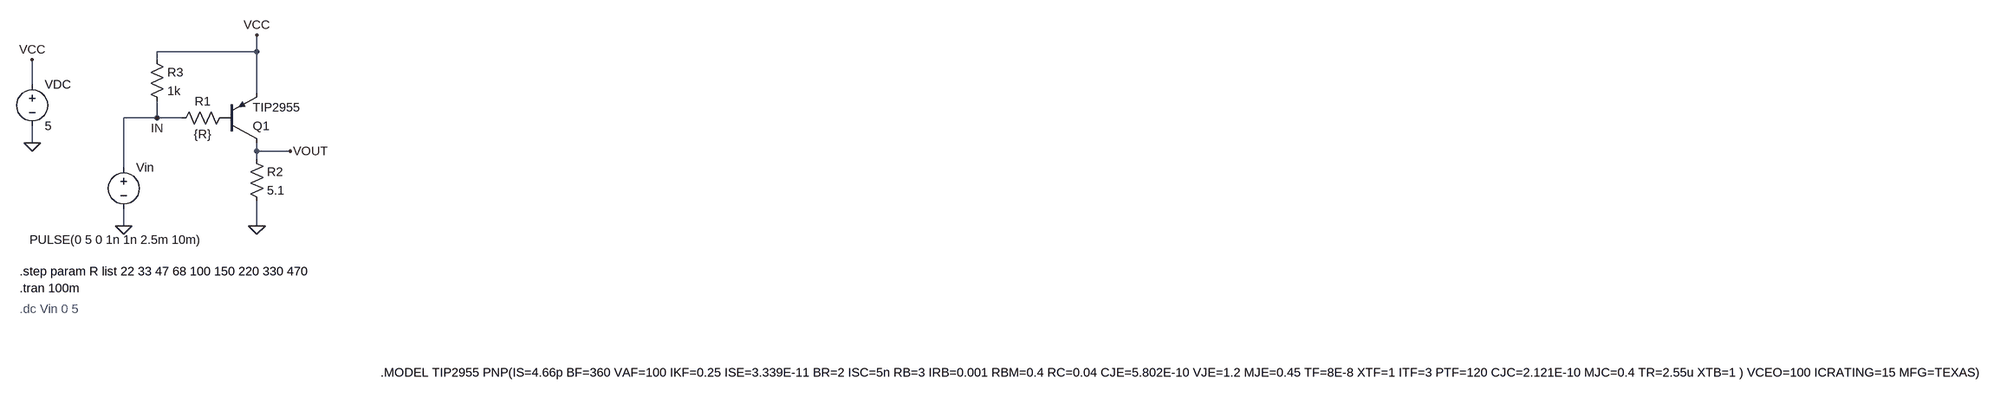
[diagram p0: schematic Simulasi_Rangkaian_Kendali_Suhu_PID.asc]
Simulasi_Rangkaian_Kendali_Suhu_PID.asc, the LTspice schematic file:
Version 4
SHEET 1 4284 944
WIRE 304 -32 304 -64
WIRE 304 -32 112 -32
WIRE 112 -16 112 -32
WIRE -128 32 -128 -16
WIRE 304 48 304 -32
WIRE 112 96 112 64
WIRE 112 96 48 96
WIRE 160 96 112 96
WIRE -128 144 -128 112
WIRE 304 160 304 144
WIRE 368 160 304 160
WIRE 304 176 304 160
WIRE 48 192 48 96
WIRE 48 304 48 272
WIRE 304 304 304 256
FLAG 48 304 0
FLAG 304 304 0
FLAG 368 160 VOUT
FLAG 304 -64 VCC
FLAG 112 96 IN
FLAG -128 144 0
FLAG -128 -16 VCC
SYMBOL voltage 48 176 R0
WINDOW 3 -181 155 Left 2
WINDOW 123 0 0 Left 0
WINDOW 39 0 0 Left 0
SYMATTR InstName Vin
SYMATTR Value PULSE(0 5 0 1n 1n 2.5m 10m)
SYMBOL res 256 80 R90
WINDOW 0 0 56 VBottom 2
WINDOW 3 32 56 VTop 2
SYMATTR InstName R1
SYMATTR Value {R}
SYMBOL pnp 240 144 M180
SYMATTR InstName Q1
SYMATTR Value TIP2955
SYMBOL res 288 160 R0
SYMATTR InstName R2
SYMATTR Value 5.1
SYMBOL res 96 -32 R0
SYMATTR InstName R3
SYMATTR Value 1k
SYMBOL voltage -128 16 R0
WINDOW 123 0 0 Left 0
WINDOW 39 0 0 Left 0
SYMATTR InstName VDC
SYMATTR Value 5
TEXT 1024 928 Left 2 !.MODEL TIP2955 PNP(IS=4.66p BF=360 VAF=100 IKF=0.25 ISE=3.339E-11 BR=2 ISC=5n RB=3 IRB=0.001 RBM=0.4 RC=0.04 CJE=5.802E-10 VJE=1.2 MJE=0.45 TF=8E-8 XTF=1 ITF=3 PTF=120 CJC=2.121E-10 MJC=0.4 TR=2.55u XTB=1 ) VCEO=100 ICRATING=15 MFG=TEXAS)
TEXT -152 392 Left 2 !.step param R list 22 33 47 68 100 150 220 330 470
TEXT -152 424 Left 2 !.tran 100m
TEXT -152 464 Left 2 ;.dc Vin 0 5

The netlist it stands for:
* Simulasi_Rangkaian_Kendali_Suhu_PID.asc
Vin IN 0 PULSE(0 5 0 1n 1n 2.5m 10m)
R1 P001 IN {R}
Q1 VOUT P001 VCC 0 TIP2955
R2 VOUT 0 5.1
R3 VCC IN 1k
VDC VCC 0 5
.model NPN NPN
.model PNP PNP
.lib standard.bjt
.MODEL TIP2955 PNP(IS=4.66p BF=360 VAF=100 IKF=0.25 ISE=3.339E-11 BR=2 ISC=5n RB=3 IRB=0.001 RBM=0.4 RC=0.04 CJE=5.802E-10 VJE=1.2 MJE=0.45 TF=8E-8 XTF=1 ITF=3 PTF=120 CJC=2.121E-10 MJC=0.4 TR=2.55u XTB=1 ) VCEO=100 ICRATING=15 MFG=TEXAS)
.step param R list 22 33 47 68 100 150 220 330 470
.tran 100m
* .dc Vin 0 5
.backanno
.end